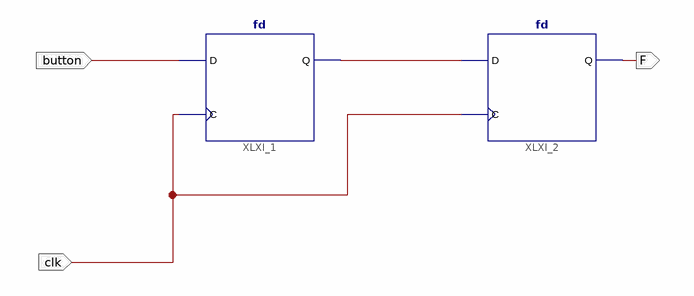
[diagram p0: schematic sheet 1]
// Xilinx ISE schematic Synchronizer.sch (spartan3e) as structural Verilog: 2 symbols, 3 ports
module Synchronizer (
  input  button,
  input  clk,
  output F
);

  wire XLXN_2;

  fd XLXI_1 (.C(clk), .D(button), .Q(XLXN_2));
  fd XLXI_2 (.C(clk), .D(XLXN_2), .Q(F));
endmodule
